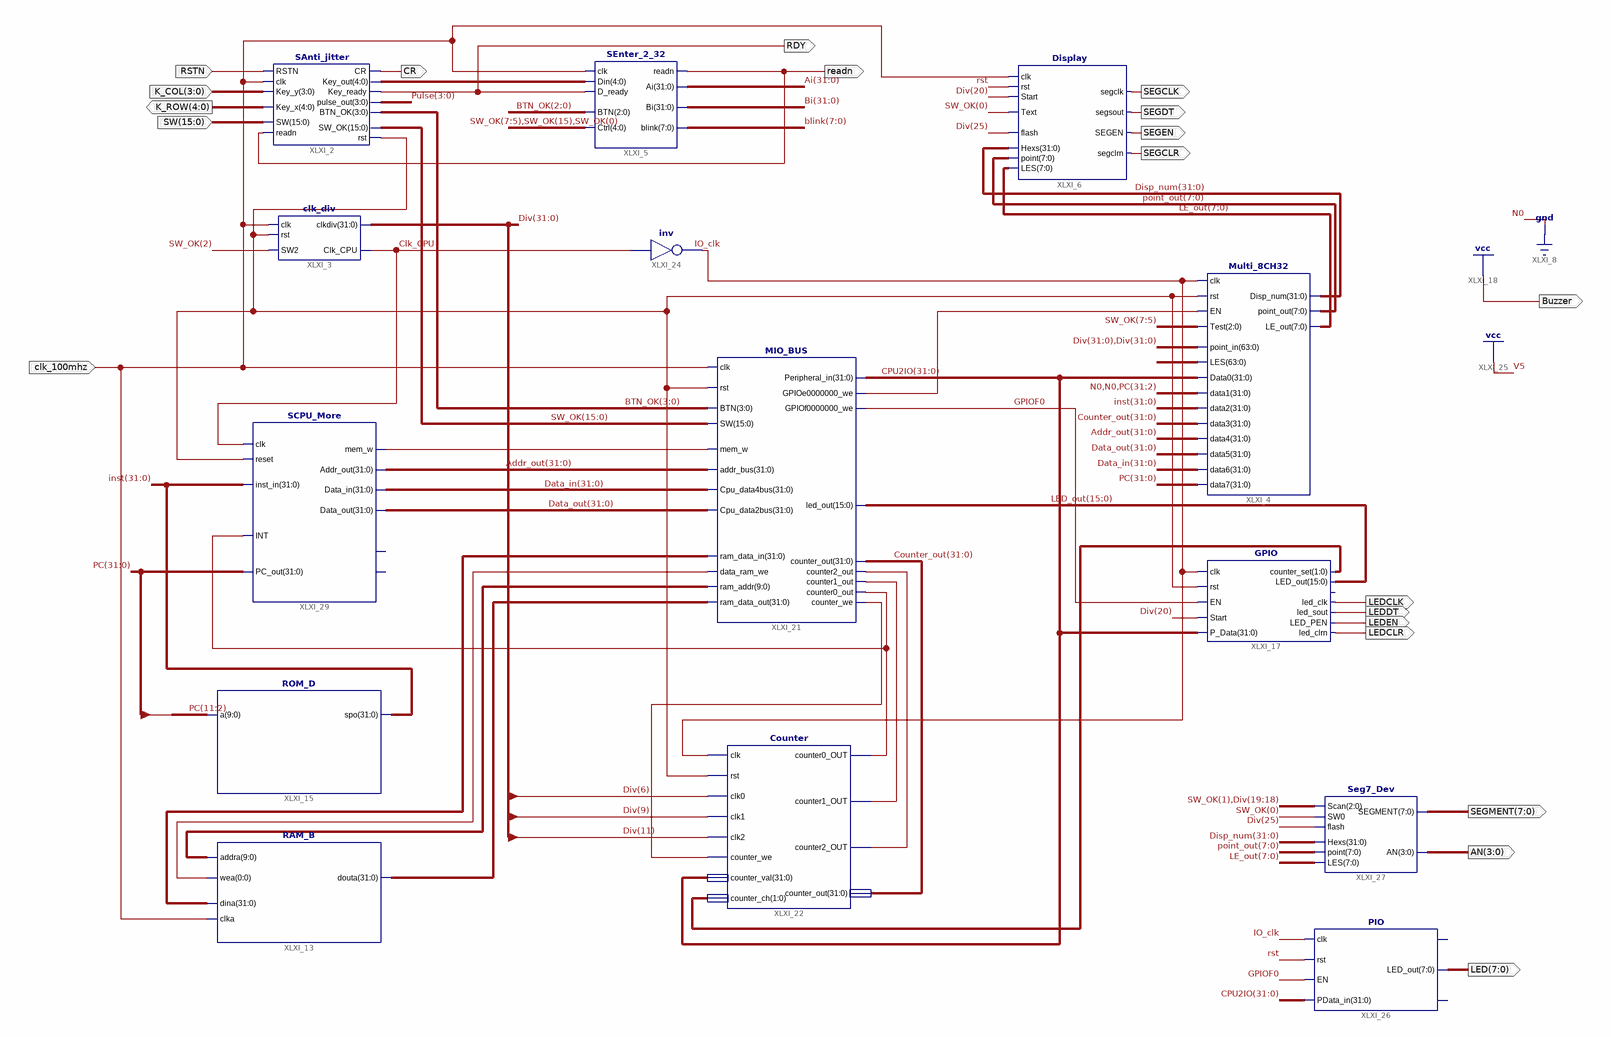
[diagram p0: schematic sheet 1]
// Xilinx ISE schematic Framework.sch (kintex7) as structural Verilog: 14 symbols, 20 ports
module Framework (
  input  RSTN,
  input  [3:0] K_COL,
  input  [15:0] SW,
  input  clk_100mhz,
  output [4:0] K_ROW,
  output CR,
  output RDY,
  output readn,
  output SEGCLK,
  output SEGDT,
  output SEGEN,
  output SEGCLR,
  output LEDCLK,
  output LEDEN,
  output LEDDT,
  output LEDCLR,
  output Buzzer,
  output [7:0] SEGMENT,
  output [3:0] AN,
  output [7:0] LED
);

  wire Clk_CPU, GPIOF0, IO_clk, rst, XLXN_269, XLXN_274, XLXN_276, XLXN_277, XLXN_278, XLXN_294, XLXN_306;
  wire [0:0] XLXN_290;
  wire [1:0] XLXN_305;
  wire [3:0] BTN_OK, Pulse;
  wire [4:0] XLXN_9;
  wire [7:0] blink, LE_out, point_out;
  wire [9:0] XLXN_289;
  wire [15:0] LED_out, SW_OK;
  wire [31:0] Addr_out, Ai, Bi, Counter_out, CPU2IO, Data_in, Data_out, Disp_num, Div, inst, PC, XLXN_288,
       XLXN_291;

  clk_div XLXI_3 (.rst(XLXN_274), .clk(clk_100mhz), .SW2(SW_OK[2]), .clkdiv(Div), .Clk_CPU(Clk_CPU));
  Multi_8CH32 XLXI_4 (
    .Test(SW_OK[7:5]), .point_in({Div, Div}), .EN(XLXN_306), .clk(IO_clk), .rst(XLXN_274), .LES({64{1'b0}}),
    .Data0(CPU2IO), .data1({2'b00, PC[31:2]}), .data2(inst), .data3(Counter_out), .data4(Addr_out),
    .data5(Data_out), .data6(Data_in), .data7(PC), .point_out(point_out), .LE_out(LE_out), .Disp_num(Disp_num));
  SAnti_jitter XLXI_2 (
    .SW(SW), .readn(readn), .Key_y(K_COL), .Key_x(K_ROW), .RSTN(RSTN), .clk(clk_100mhz), .Key_out(XLXN_9),
    .Key_ready(RDY), .CR(CR), .rst(XLXN_274), .SW_OK(SW_OK), .pulse_out(Pulse), .BTN_OK(BTN_OK));
  SEnter_2_32 XLXI_5 (
    .readn(readn), .Ai(Ai), .Bi(Bi), .blink(blink), .Din(XLXN_9), .D_ready(RDY), .clk(clk_100mhz),
    .Ctrl({SW_OK[7:5], SW_OK[15], SW_OK[0]}), .BTN(BTN_OK[2:0]));
  Display XLXI_6 (
    .LES(LE_out), .SEGEN(SEGEN), .segsout(SEGDT), .segclrn(SEGCLR), .point(point_out), .Hexs(Disp_num),
    .Text(SW_OK[0]), .flash(Div[25]), .segclk(SEGCLK), .clk(clk_100mhz), .rst(rst), .Start(Div[20]));
  ROM_D XLXI_15 (.a(PC[11:2]), .spo(inst));
  RAM_B XLXI_13 (.addra(XLXN_289), .clka(clk_100mhz), .wea(XLXN_290[0]), .dina(XLXN_291), .douta(XLXN_288));
  GPIO XLXI_17 (
    .clk(IO_clk), .P_Data(CPU2IO), .rst(XLXN_274), .EN(GPIOF0), .Start(Div[20]), .led_clk(LEDCLK),
    .LED_out(LED_out), .counter_set(XLXN_305), .led_clrn(LEDCLR), .LED_PEN(LEDEN), .led_sout(LEDDT));  // open: GPIOf0
  MIO_BUS XLXI_21 (
    .rst(XLXN_274), .clk(clk_100mhz), .mem_w(XLXN_269), .addr_bus(Addr_out), .Cpu_data4bus(Data_in),
    .Cpu_data2bus(Data_out), .ram_data_out(XLXN_288), .ram_addr(XLXN_289), .data_ram_we(XLXN_290[0]),
    .ram_data_in(XLXN_291), .counter_out(Counter_out), .counter2_out(XLXN_278), .counter1_out(XLXN_277),
    .counter0_out(XLXN_276), .counter_we(XLXN_294), .BTN(BTN_OK), .SW(SW_OK), .led_out(LED_out),
    .Peripheral_in(CPU2IO), .GPIOe0000000_we(XLXN_306), .GPIOf0000000_we(GPIOF0));
  Counter XLXI_22 (
    .clk(IO_clk), .rst(XLXN_274), .clk0(Div[6]), .clk1(Div[9]), .clk2(Div[11]), .counter_we(XLXN_294),
    .counter_val(CPU2IO), .counter_ch(XLXN_305), .counter0_OUT(XLXN_276), .counter1_OUT(XLXN_277),
    .counter2_OUT(XLXN_278), .counter_out(Counter_out));
  not XLXI_24 (IO_clk, Clk_CPU);
  PIO XLXI_26 (.clk(IO_clk), .rst(rst), .EN(GPIOF0), .PData_in(CPU2IO), .LED_out(LED));  // open: GPIOf0, counter_set
  Seg7_Dev XLXI_27 (
    .LES(LE_out), .Scan({SW_OK[1], Div[19:18]}), .SEGMENT(SEGMENT), .AN(AN), .point(point_out),
    .flash(Div[25]), .SW0(SW_OK[0]), .Hexs(Disp_num));
  SCPU_More XLXI_29 (
    .clk(Clk_CPU), .reset(XLXN_274), .inst_in(inst), .INT(XLXN_276), .Addr_out(Addr_out), .mem_w(XLXN_269),
    .Data_out(Data_out), .Data_in(Data_in), .PC_out(PC));  // open: CPU_MIO, MIO_ready

  assign Buzzer = 1'b1;
endmodule
